# Altium project PlacaBase_agus.PrjPcb
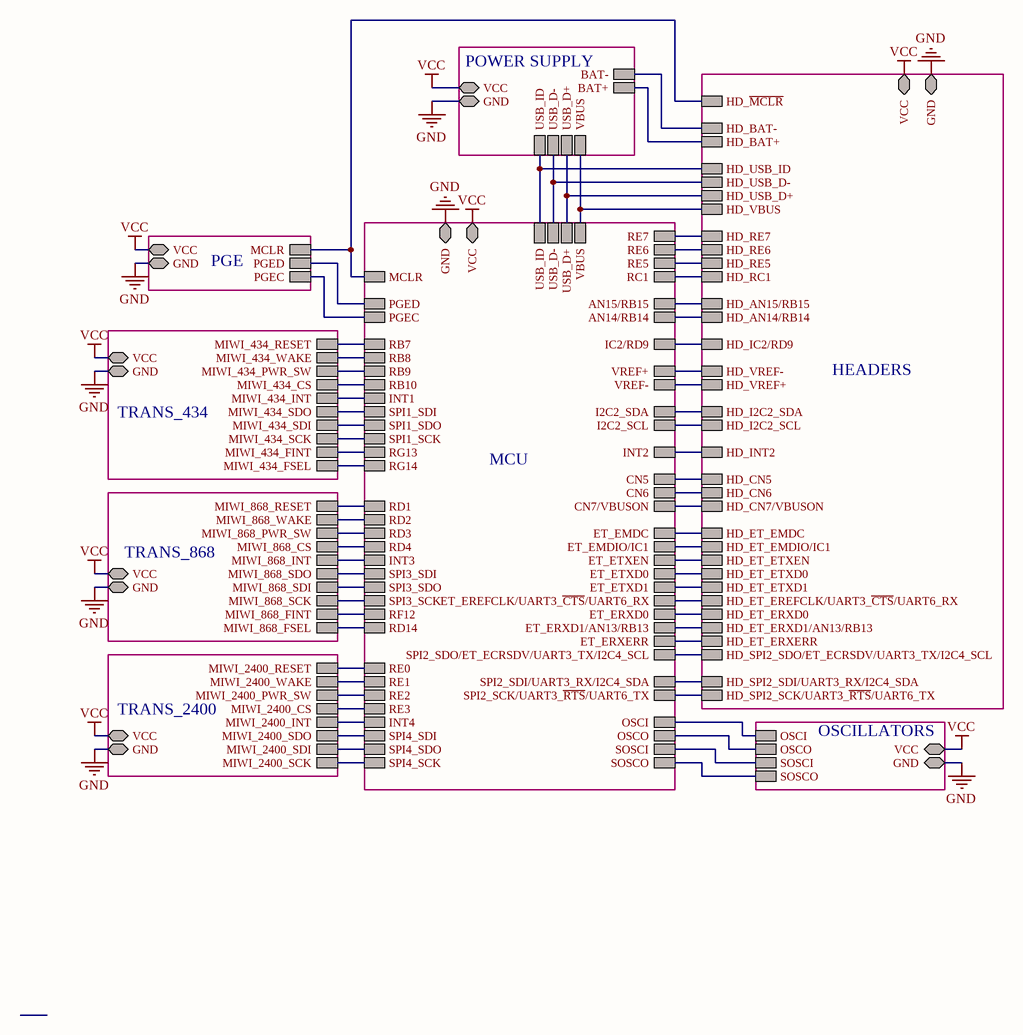
[diagram p0: PlacaBase_agus.SchDoc]
9 sheets, 60 parts. Net scope: hierarchical (ports join the sheet entries above them; power ports are global).
Board file: PlacaBase_agus.PcbDoc
Sheets:
  PlacaBase_agus.SchDoc
    PGE = PGE.SchDoc
    OSCILLATORS = oscillators.SchDoc
    HEADERS = headers.SchDoc
    TRANS_434 = transc_MIWI434.SchDoc
    TRANS_868 = transc_MIWI868.SchDoc
    TRANS_2400 = transc_MIWI2400.SchDoc
    POWER SUPPLY = power_supply.SchDoc
    MCU = MCU.SchDoc

## Sheet PlacaBase_agus.SchDoc
size B; PageSetup: Record=PageOptions|CenterHorizontal=True|CenterVertical=True|PrintScale=1.00|XCorrection=1.00|YCorrection=1.00|PrintKind=1|BorderSize=5000000|LeftOffset=0|BottomOffset=0|Orientation=2|PaperLength=1000|PaperWidth=1000|Scale=100|PaperSource=7|PrintQuality=-4|MediaType=1|DitherType=10|PaperKind=A4|PrintScaleMode=1

### Sub-sheets
HEADERS = headers.SchDoc: HD_RE5, HD_RE6, HD_RE7, HD_RC1, HD_AN15/RB15, HD_AN14/RB14, HD_INT2, HD_VREF+, HD_VREF-, HD_I2C2_SDA, HD_I2C2_SCL, HD_BAT+, HD_~{MCLR}, HD_CN6, HD_CN5, HD_CN7/VBUSON, HD_IC2/RD9, HD_BAT-, HD_USB_ID, HD_USB_D+, HD_USB_D-, HD_VBUS, HD_ET_EMDC, HD_ET_ETXEN, HD_ET_ETXD0, HD_ET_ETXD1, HD_ET_ERXD0, HD_ET_ERXERR, HD_SPI2_SCK/UART3_~{RTS}/UART6_TX, HD_SPI2_SDI/UART3_RX/I2C4_SDA, HD_SPI2_SDO/ET_ECRSDV/UART3_TX/I2C4_SCL, HD_ET_EREFCLK/UART3_~{CTS}/UART6_RX, HD_ET_EMDIO/IC1, HD_ET_ERXD1/AN13/RB13, VCC, GND
MCU = MCU.SchDoc: VBUS, PGED, PGEC, MCLR, SPI4_SDI, SPI4_SDO, SPI4_SCK, SPI1_SDO, SPI1_SDI, SPI1_SCK, SPI3_SCK, SPI3_SDI, SPI3_SDO, USB_ID, USB_D-, USB_D+, OSCI, OSCO, SOSCI, SOSCO, RE0, RE1, RE3, RB7, RD1, RB8, RD2, RB9, RD3, INT3, INT1, INT2, RB10, RD4, RE2, INT4, RE7, RE6, RE5, RC1, VREF-, VREF+, AN15/RB15, AN14/RB14, ET_ERXD1/AN13/RB13, I2C2_SCL, I2C2_SDA, CN7/VBUSON, CN6, CN5, ET_EMDIO/IC1, IC2/RD9, SPI2_SCK/UART3_~{RTS}/UART6_TX, SPI2_SDI/UART3_RX/I2C4_SDA, SPI2_SDO/ET_ECRSDV/UART3_TX/I2C4_SCL, ET_EREFCLK/UART3_~{CTS}/UART6_RX, ET_EMDC, ET_ETXEN, ET_ETXD0, ET_ETXD1, ET_ERXD0, ET_ERXERR, GND, VCC, RD14, RF12, RG13, RG14
OSCILLATORS = oscillators.SchDoc: OSCI, OSCO, SOSCI, SOSCO, VCC, GND
PGE = PGE.SchDoc: MCLR, PGED, PGEC, VCC, GND
POWER SUPPLY = power_supply.SchDoc: USB_ID, USB_D-, USB_D+, VBUS, BAT-, BAT+, GND, VCC
TRANS_434 = transc_MIWI434.SchDoc: MIWI_434_RESET, MIWI_434_WAKE, MIWI_434_INT, MIWI_434_SDI, MIWI_434_SCK, MIWI_434_CS, MIWI_434_SDO, MIWI_434_PWR_SW, VCC, GND, MIWI_434_FINT, MIWI_434_FSEL
TRANS_868 = transc_MIWI868.SchDoc: MIWI_868_RESET, MIWI_868_WAKE, MIWI_868_INT, MIWI_868_SDI, MIWI_868_SCK, MIWI_868_CS, MIWI_868_SDO, MIWI_868_PWR_SW, VCC, GND, MIWI_868_FINT, MIWI_868_FSEL
TRANS_2400 = transc_MIWI2400.SchDoc: MIWI_2400_RESET, MIWI_2400_WAKE, MIWI_2400_INT, MIWI_2400_SDI, MIWI_2400_SCK, MIWI_2400_CS, MIWI_2400_SDO, MIWI_2400_PWR_SW, VCC, GND

### Nets
GND: sheet PGE/GND, sheet OSCILLATORS/GND, sheet HEADERS/HD_BAT-, sheet HEADERS/GND, sheet TRANS_434/GND, sheet TRANS_868/GND, sheet TRANS_2400/GND, sheet POWER SUPPLY/BAT-, sheet POWER SUPPLY/GND, sheet MCU/GND
VCC: sheet PGE/VCC, sheet OSCILLATORS/VCC, sheet HEADERS/VCC, sheet TRANS_434/VCC, sheet TRANS_868/VCC, sheet TRANS_2400/VCC, sheet POWER SUPPLY/VCC, sheet MCU/VCC
VCC5.0_POWER: sheet HEADERS/HD_VBUS, sheet POWER SUPPLY/VBUS, sheet MCU/VBUS
NetC15_2: sheet OSCILLATORS/SOSCI, sheet MCU/SOSCI
NetC16_2: sheet OSCILLATORS/SOSCO, sheet MCU/SOSCO
NetC17_2: sheet OSCILLATORS/OSCI, sheet MCU/OSCI
NetC18_2: sheet OSCILLATORS/OSCO, sheet MCU/OSCO
Nethd40_00: sheet HEADERS/HD_INT2, sheet MCU/INT2
Nethd40_01: sheet HEADERS/HD_CN7/VBUSON, sheet MCU/CN7/VBUSON
Nethd40_02: sheet HEADERS/HD_CN5, sheet MCU/CN5
Nethd40_03: sheet HEADERS/HD_ET_ERXERR, sheet MCU/ET_ERXERR
Nethd40_04: sheet HEADERS/HD_ET_ERXD0, sheet MCU/ET_ERXD0
Nethd40_05: sheet HEADERS/HD_ET_ERXD1/AN13/RB13, sheet MCU/ET_ERXD1/AN13/RB13
Nethd40_06: sheet HEADERS/HD_USB_ID, sheet POWER SUPPLY/USB_ID, sheet MCU/USB_ID
Nethd40_08: sheet PGE/MCLR, sheet HEADERS/HD_~{MCLR}, sheet MCU/MCLR
Nethd40_09: sheet HEADERS/HD_ET_EMDIO/IC1, sheet MCU/ET_EMDIO/IC1
Nethd40_10: sheet HEADERS/HD_I2C2_SDA, sheet MCU/I2C2_SDA
Nethd40_11: sheet HEADERS/HD_I2C2_SCL, sheet MCU/I2C2_SCL
Nethd40_12: sheet HEADERS/HD_USB_D+, sheet POWER SUPPLY/USB_D+, sheet MCU/USB_D+
Nethd40_13: sheet HEADERS/HD_USB_D-, sheet POWER SUPPLY/USB_D-, sheet MCU/USB_D-
Nethd40_16: sheet HEADERS/HD_AN15/RB15, sheet MCU/AN15/RB15
Nethd40_17: sheet HEADERS/HD_AN14/RB14, sheet MCU/AN14/RB14
Nethd40_18: sheet HEADERS/HD_VREF-, sheet MCU/VREF+
Nethd40_19: sheet HEADERS/HD_VREF+, sheet MCU/VREF-
Nethd40_20: sheet HEADERS/HD_ET_EREFCLK/UART3_~{CTS}/UART6_RX, sheet MCU/ET_EREFCLK/UART3_~{CTS}/UART6_RX
Nethd40_21: sheet HEADERS/HD_SPI2_SDI/UART3_RX/I2C4_SDA, sheet MCU/SPI2_SDI/UART3_RX/I2C4_SDA
Nethd40_22: sheet HEADERS/HD_RE7, sheet MCU/RE7
Nethd40_23: sheet HEADERS/HD_RE5, sheet MCU/RE5
Nethd40_25: sheet HEADERS/HD_ET_ETXD0, sheet MCU/ET_ETXD0
Nethd40_26: sheet HEADERS/HD_ET_ETXD1, sheet MCU/ET_ETXD1
Nethd40_27: sheet HEADERS/HD_ET_EMDC, sheet MCU/ET_EMDC
Nethd40_29: sheet HEADERS/HD_BAT+, sheet POWER SUPPLY/BAT+
Nethd40_32: sheet HEADERS/HD_IC2/RD9, sheet MCU/IC2/RD9
Nethd40_33: sheet HEADERS/HD_ET_ETXEN, sheet MCU/ET_ETXEN
Nethd40_35: sheet HEADERS/HD_RE6, sheet MCU/RE6
Nethd40_36: sheet HEADERS/HD_RC1, sheet MCU/RC1
Nethd40_37: sheet HEADERS/HD_SPI2_SCK/UART3_~{RTS}/UART6_TX, sheet MCU/SPI2_SCK/UART3_~{RTS}/UART6_TX
Nethd40_38: sheet HEADERS/HD_SPI2_SDO/ET_ECRSDV/UART3_TX/I2C4_SCL, sheet MCU/SPI2_SDO/ET_ECRSDV/UART3_TX/I2C4_SCL
Nethd40_39: sheet HEADERS/HD_CN6, sheet MCU/CN6
NetMRF24J40MA_2: sheet TRANS_2400/MIWI_2400_RESET, sheet MCU/RE0
NetMRF24J40MA_3: sheet TRANS_2400/MIWI_2400_WAKE, sheet MCU/RE1
NetMRF24J40MA_4: sheet TRANS_2400/MIWI_2400_INT, sheet MCU/INT4
NetMRF24J40MA_5: sheet TRANS_2400/MIWI_2400_SDI, sheet MCU/SPI4_SDO
NetMRF24J40MA_6: sheet TRANS_2400/MIWI_2400_SCK, sheet MCU/SPI4_SCK
NetMRF24J40MA_7: sheet TRANS_2400/MIWI_2400_SDO, sheet MCU/SPI4_SDI
NetMRF24J40MA_8: sheet TRANS_2400/MIWI_2400_CS, sheet MCU/RE3
NetMRF49XAmboard_434_2: sheet TRANS_434/MIWI_434_RESET, sheet MCU/RB7
NetMRF49XAmboard_434_3: sheet TRANS_434/MIWI_434_WAKE, sheet MCU/RB8
NetMRF49XAmboard_434_4: sheet TRANS_434/MIWI_434_INT, sheet MCU/INT1
NetMRF49XAmboard_434_5: sheet TRANS_434/MIWI_434_SDI, sheet MCU/SPI1_SDO
NetMRF49XAmboard_434_6: sheet TRANS_434/MIWI_434_SCK, sheet MCU/SPI1_SCK
NetMRF49XAmboard_434_7: sheet TRANS_434/MIWI_434_SDO, sheet MCU/SPI1_SDI
NetMRF49XAmboard_434_8: sheet TRANS_434/MIWI_434_CS, sheet MCU/RB10
NetMRF49XAmboard_434_9: sheet TRANS_434/MIWI_434_FSEL, sheet MCU/RG14
NetMRF49XAmboard_434_10: sheet TRANS_434/MIWI_434_FINT, sheet MCU/RG13
NetMRF49XAmboard_868_2: sheet TRANS_868/MIWI_868_RESET, sheet MCU/RD1
NetMRF49XAmboard_868_3: sheet TRANS_868/MIWI_868_WAKE, sheet MCU/RD2
NetMRF49XAmboard_868_4: sheet TRANS_868/MIWI_868_INT, sheet MCU/INT3
NetMRF49XAmboard_868_5: sheet TRANS_868/MIWI_868_SDI, sheet MCU/SPI3_SDO
NetMRF49XAmboard_868_6: sheet TRANS_868/MIWI_868_SCK, sheet MCU/SPI3_SCK
NetMRF49XAmboard_868_7: sheet TRANS_868/MIWI_868_SDO, sheet MCU/SPI3_SDI
NetMRF49XAmboard_868_8: sheet TRANS_868/MIWI_868_CS, sheet MCU/RD4
NetMRF49XAmboard_868_9: sheet TRANS_868/MIWI_868_FSEL, sheet MCU/RD14
NetMRF49XAmboard_868_10: sheet TRANS_868/MIWI_868_FINT, sheet MCU/RF12
NetPC_434_6: sheet TRANS_434/MIWI_434_PWR_SW, sheet MCU/RB9
NetPC_868_6: sheet TRANS_868/MIWI_868_PWR_SW, sheet MCU/RD3
NetPC_2400_6: sheet TRANS_2400/MIWI_2400_PWR_SW, sheet MCU/RE2
NetPGE_2: sheet PGE/PGEC, sheet MCU/PGEC
NetPGE_3: sheet PGE/PGED, sheet MCU/PGED

## Sheet PGE.SchDoc
size A
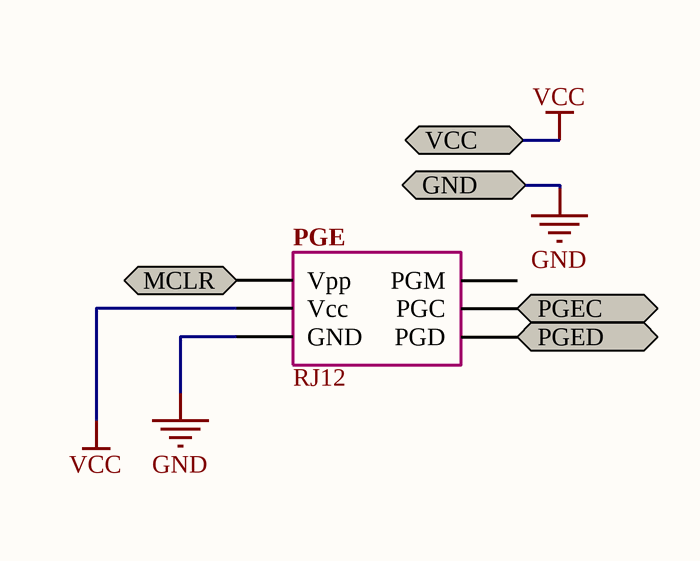
[diagram p1: PGE.SchDoc]

### Parts
PGE  RJ12  [RJ12]

### Ports
GND, MCLR, PGEC, PGED, VCC

### Nets
GND: PGE.4(GND) ; port GND
VCC: PGE.5(Vcc) ; port VCC
Nethd40_08: PGE.6(Vpp) ; port MCLR
NetPGE_2: PGE.2(PGC) ; port PGEC
NetPGE_3: PGE.3(PGD) ; port PGED

Not connected (* = marked no-connect by the designer): PGE 1(PGM)

### Library data of the parts
PGE = RJ12: Conector RJ-12; Note: Not recommended for new designs. Consider PIC16C72A or PIC16F72 instead.; buy: farnell:3938359; Published: 8-Jun-2000; LatestRevisionDate: 13-Apr-2006; LatestRevisionNote: IPC-7351 Footprint Added.; DatasheetVersion: DS39016A_1998; PackageVersion: 2005; PackageReference: SOIC300-28; Publisher: Altium Limited; PackageDescription: 28-Pin Small Outline Integrated Circuit 1.27 mm Pitch; Code_JEDEC: MS-013; ComponentLink1Description: Manufacturer Link; ComponentLink1URL: http://www.microchip.com; ComponentLink2Description: Datasheet; ComponentLink2URL: http://ww1.microchip.com/downloads/en/DeviceDoc/39016a.pdf; ComponentLink3Description: Packaging Specification; ComponentLink3URL: http://ww1.microchip.com/downloads/en/PackagingSpec/00049AD.pdf

## Sheet oscillators.SchDoc
size A
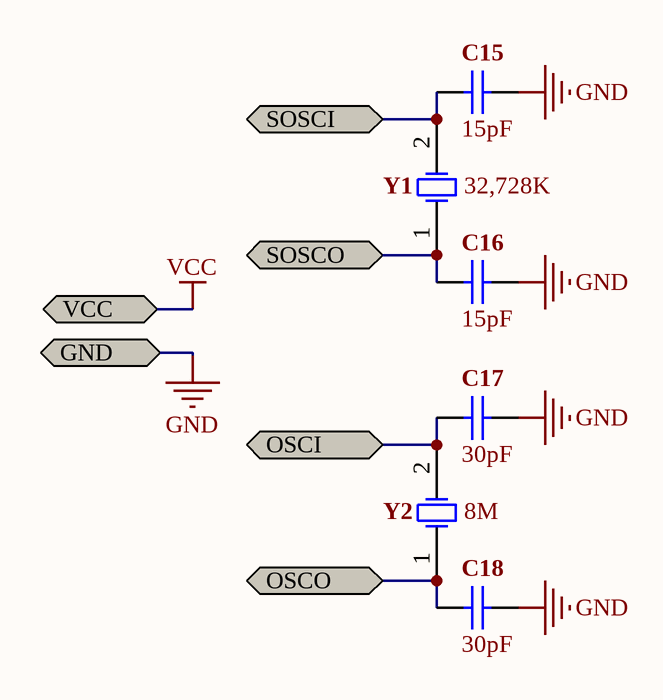
[diagram p2: oscillators.SchDoc]

### Parts
C15  value 15pF  [1608[0603]]  (hidden comment: Cap)
C16  value 15pF  [1608[0603]]  (hidden comment: Cap)
C17  value 30pF  [1608[0603]]  (hidden comment: Cap)
C18  value 30pF  [1608[0603]]  (hidden comment: Cap)
Y1  32,728K  [BCY-W2/D3.1]
Y2  8M  [49_SMD_8Mhz]

### Ports
GND, OSCI, OSCO, SOSCI, SOSCO, VCC

### Nets
GND: C15.1 C16.1 C17.1 C18.1 ; port GND
NetC15_2: C15.2 Y1.2(OSC2) ; port SOSCI
NetC16_2: C16.2 Y1.1(OSC1) ; port SOSCO
NetC17_2: C17.2 Y2.2(OSC2) ; port OSCI
NetC18_2: C18.2 Y2.1(OSC1) ; port OSCO

### Library data of the parts
C15-C18 = Cap: Capacitor; Published: 8-Jun-2000; LatestRevisionDate: 17-Jul-2002; LatestRevisionNote: Re-released for DXP Platform.; PackageReference: RAD-0.3; Publisher: Altium Limited; PackageDescription: Radial Cap, Thru-Hole; 2 Leads; 0.3 in Pin Spacing
Y1 Y2 = XTAL_2PINS: Crystal Oscillator; buy: farnell:1701100; Published: 8-Jun-2000; LatestRevisionDate: 17-Jul-2002; LatestRevisionNote: Re-released for DXP Platform.; PackageReference: R38; Publisher: Altium Limited

## Sheet headers.SchDoc
size A4
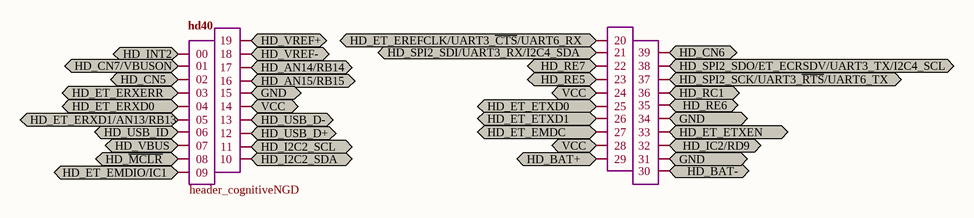
[diagram p3: headers.SchDoc]

### Parts
hd40  header_cognitiveNGD  [header_cognitiveNGD]

### Ports
GND, HD_AN14/RB14, HD_AN15/RB15, HD_BAT+, HD_BAT-, HD_CN5, HD_CN6, HD_CN7/VBUSON, HD_ET_EMDC, HD_ET_EMDIO/IC1, HD_ET_EREFCLK/UART3_~{CTS}/UART6_RX, HD_ET_ERXD0, HD_ET_ERXD1/AN13/RB13, HD_ET_ERXERR, HD_ET_ETXD0, HD_ET_ETXD1, HD_ET_ETXEN, HD_I2C2_SCL, HD_I2C2_SDA, HD_IC2/RD9, HD_INT2, HD_RC1, HD_RE5, HD_RE6, HD_RE7, HD_SPI2_SCK/UART3_~{RTS}/UART6_TX, HD_SPI2_SDI/UART3_RX/I2C4_SDA, HD_SPI2_SDO/ET_ECRSDV/UART3_TX/I2C4_SCL, HD_USB_D+, HD_USB_D-, HD_USB_ID, HD_VBUS, HD_VREF+, HD_VREF-, HD_~{MCLR}, VCC

### Nets
GND: hd40.15 hd40.30 hd40.31 hd40.34 ; port GND, port HD_BAT-
VCC: hd40.14 hd40.24 hd40.28 ; port VCC
VCC5.0_POWER: hd40.07 ; port HD_VBUS
Nethd40_00: hd40.00 ; port HD_INT2
Nethd40_01: hd40.01 ; port HD_CN7/VBUSON
Nethd40_02: hd40.02 ; port HD_CN5
Nethd40_03: hd40.03 ; port HD_ET_ERXERR
Nethd40_04: hd40.04 ; port HD_ET_ERXD0
Nethd40_05: hd40.05 ; port HD_ET_ERXD1/AN13/RB13
Nethd40_06: hd40.06 ; port HD_USB_ID
Nethd40_08: hd40.08 ; port HD_~{MCLR}
Nethd40_09: hd40.09 ; port HD_ET_EMDIO/IC1
Nethd40_10: hd40.10 ; port HD_I2C2_SDA
Nethd40_11: hd40.11 ; port HD_I2C2_SCL
Nethd40_12: hd40.12 ; port HD_USB_D+
Nethd40_13: hd40.13 ; port HD_USB_D-
Nethd40_16: hd40.16 ; port HD_AN15/RB15
Nethd40_17: hd40.17 ; port HD_AN14/RB14
Nethd40_18: hd40.18 ; port HD_VREF-
Nethd40_19: hd40.19 ; port HD_VREF+
Nethd40_20: hd40.20 ; port HD_ET_EREFCLK/UART3_~{CTS}/UART6_RX
Nethd40_21: hd40.21 ; port HD_SPI2_SDI/UART3_RX/I2C4_SDA
Nethd40_22: hd40.22 ; port HD_RE7
Nethd40_23: hd40.23 ; port HD_RE5
Nethd40_25: hd40.25 ; port HD_ET_ETXD0
Nethd40_26: hd40.26 ; port HD_ET_ETXD1
Nethd40_27: hd40.27 ; port HD_ET_EMDC
Nethd40_29: hd40.29 ; port HD_BAT+
Nethd40_32: hd40.32 ; port HD_IC2/RD9
Nethd40_33: hd40.33 ; port HD_ET_ETXEN
Nethd40_35: hd40.35 ; port HD_RE6
Nethd40_36: hd40.36 ; port HD_RC1
Nethd40_37: hd40.37 ; port HD_SPI2_SCK/UART3_~{RTS}/UART6_TX
Nethd40_38: hd40.38 ; port HD_SPI2_SDO/ET_ECRSDV/UART3_TX/I2C4_SCL
Nethd40_39: hd40.39 ; port HD_CN6

## Sheet transc_MIWI434.SchDoc
size A
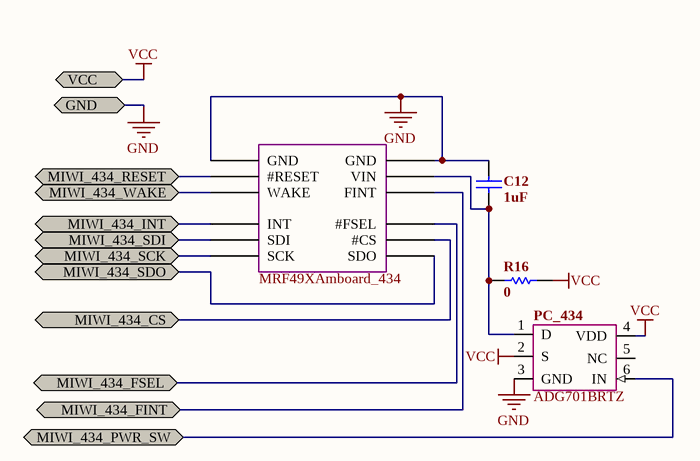
[diagram p4: transc_MIWI434.SchDoc]

### Parts
C12  value 1uF  [1608[0603]]  (hidden comment: Cap)
MRF49XAmboard_434  MRF49XAmboard  [MRF49XAmboard]  (value not drawn)
PC_434  ADG701BRTZ  [SOT23-6_L]
R16  value 0  [1608[0603]]  (hidden comment: resistor)

### Ports
GND, MIWI_434_CS, MIWI_434_FINT, MIWI_434_FSEL, MIWI_434_INT, MIWI_434_PWR_SW, MIWI_434_RESET, MIWI_434_SCK, MIWI_434_SDI, MIWI_434_SDO, MIWI_434_WAKE, VCC

### Nets
GND: C12.1 MRF49XAmboard_434.1(GND) MRF49XAmboard_434.12(GND) PC_434.3(GND) ; port GND
VCC: PC_434.2(S) PC_434.4(VDD) R16.1 ; port VCC
NetC12_2: C12.2 MRF49XAmboard_434.11(VIN) PC_434.1(D) R16.2
NetMRF49XAmboard_434_2: MRF49XAmboard_434.2(#RESET) ; port MIWI_434_RESET
NetMRF49XAmboard_434_3: MRF49XAmboard_434.3(WAKE) ; port MIWI_434_WAKE
NetMRF49XAmboard_434_4: MRF49XAmboard_434.4(INT) ; port MIWI_434_INT
NetMRF49XAmboard_434_5: MRF49XAmboard_434.5(SDI) ; port MIWI_434_SDI
NetMRF49XAmboard_434_6: MRF49XAmboard_434.6(SCK) ; port MIWI_434_SCK
NetMRF49XAmboard_434_7: MRF49XAmboard_434.7(SDO) ; port MIWI_434_SDO
NetMRF49XAmboard_434_8: MRF49XAmboard_434.8(#CS) ; port MIWI_434_CS
NetMRF49XAmboard_434_9: MRF49XAmboard_434.9(#FSEL) ; port MIWI_434_FSEL
NetMRF49XAmboard_434_10: MRF49XAmboard_434.10(FINT) ; port MIWI_434_FINT
NetPC_434_6: PC_434.6(IN) ; port MIWI_434_PWR_SW

Not connected (* = marked no-connect by the designer): PC_434 5(NC)

### Library data of the parts
C12 = Cap: Capacitor
MRF49XAmboard_434 = MRF49XAmboard: Microchip RF radio; buy: farnell:1630202
R16 = RES

## Sheet transc_MIWI868.SchDoc
size A
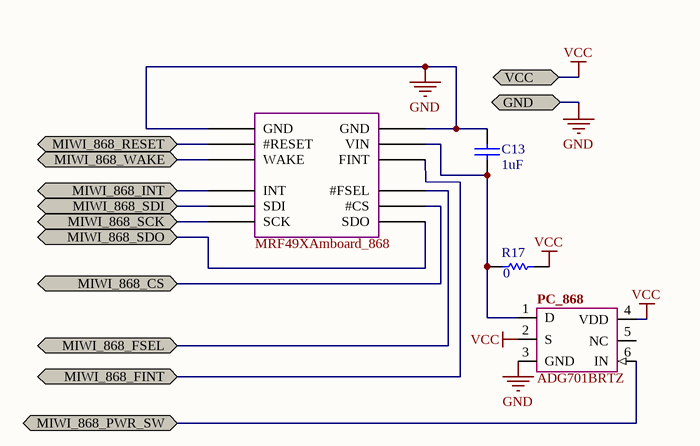
[diagram p5: transc_MIWI868.SchDoc]

### Parts
C13  value 1uF  [1608[0603]]  (hidden comment: Cap)
MRF49XAmboard_868  MRF49XAmboard  [MRF49XAmboard]  (value not drawn)
PC_868  ADG701BRTZ  [SOT23-6_L]
R17  value 0  [1608[0603]]  (hidden comment: resistor)

### Ports
GND, MIWI_868_CS, MIWI_868_FINT, MIWI_868_FSEL, MIWI_868_INT, MIWI_868_PWR_SW, MIWI_868_RESET, MIWI_868_SCK, MIWI_868_SDI, MIWI_868_SDO, MIWI_868_WAKE, VCC

### Nets
GND: C13.1 MRF49XAmboard_868.1(GND) MRF49XAmboard_868.12(GND) PC_868.3(GND) ; port GND
VCC: PC_868.2(S) PC_868.4(VDD) R17.1 ; port VCC
NetC13_2: C13.2 MRF49XAmboard_868.11(VIN) PC_868.1(D) R17.2
NetMRF49XAmboard_868_2: MRF49XAmboard_868.2(#RESET) ; port MIWI_868_RESET
NetMRF49XAmboard_868_3: MRF49XAmboard_868.3(WAKE) ; port MIWI_868_WAKE
NetMRF49XAmboard_868_4: MRF49XAmboard_868.4(INT) ; port MIWI_868_INT
NetMRF49XAmboard_868_5: MRF49XAmboard_868.5(SDI) ; port MIWI_868_SDI
NetMRF49XAmboard_868_6: MRF49XAmboard_868.6(SCK) ; port MIWI_868_SCK
NetMRF49XAmboard_868_7: MRF49XAmboard_868.7(SDO) ; port MIWI_868_SDO
NetMRF49XAmboard_868_8: MRF49XAmboard_868.8(#CS) ; port MIWI_868_CS
NetMRF49XAmboard_868_9: MRF49XAmboard_868.9(#FSEL) ; port MIWI_868_FSEL
NetMRF49XAmboard_868_10: MRF49XAmboard_868.10(FINT) ; port MIWI_868_FINT
NetPC_868_6: PC_868.6(IN) ; port MIWI_868_PWR_SW

Not connected (* = marked no-connect by the designer): PC_868 5(NC)

### Library data of the parts
C13 = Cap: Capacitor; Published: 8-Jun-2000; LatestRevisionDate: 17-Jul-2002; LatestRevisionNote: Re-released for DXP Platform.; PackageReference: RAD-0.3; Publisher: Altium Limited; PackageDescription: Radial Cap, Thru-Hole; 2 Leads; 0.3 in Pin Spacing
MRF49XAmboard_868 = MRF49XAmboard: Microchip RF radio; buy: farnell:1630202
R17 = RES: Published: 8-Jun-2000; LatestRevisionDate: 17-Jul-2002; LatestRevisionNote: Re-released for DXP Platform.; PackageReference: AXIAL-0.3; Publisher: Altium Limited; PackageDescription: Axial Device, Thru-Hole; 2 Leads; 0.3 in Pin Spacing

## Sheet transc_MIWI2400.SchDoc
size A; PageSetup: Record=PageOptions|CenterHorizontal=True|CenterVertical=True|PrintScale=1.00|XCorrection=1.00|YCorrection=1.00|PrintKind=1|BorderSize=5000000|LeftOffset=0|BottomOffset=0|Orientation=2|PaperLength=1000|PaperWidth=1000|Scale=100|PaperSource=7|PrintQuality=-4|MediaType=1|DitherType=10|PaperKind=A4|PrintScaleMode=1
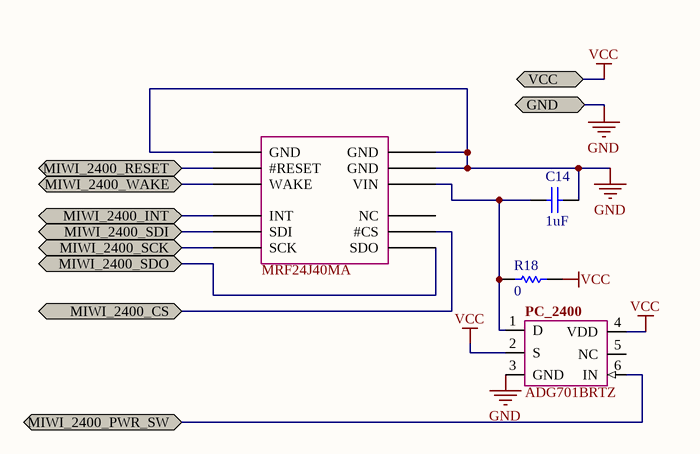
[diagram p6: transc_MIWI2400.SchDoc]

### Parts
C14  value 1uF  [1608[0603]]  (hidden comment: Cap)
MRF24J40MA  MRF24J40MA  [MRF24J40MA]  (value not drawn)
PC_2400  ADG701BRTZ  [SOT23-6_L]
R18  value 0  [1608[0603]]  (hidden comment: resistor)

### Ports
GND, MIWI_2400_CS, MIWI_2400_INT, MIWI_2400_PWR_SW, MIWI_2400_RESET, MIWI_2400_SCK, MIWI_2400_SDI, MIWI_2400_SDO, MIWI_2400_WAKE, VCC

### Nets
GND: C14.1 MRF24J40MA.1(GND) MRF24J40MA.11(GND) MRF24J40MA.12(GND) PC_2400.3(GND) ; port GND
VCC: PC_2400.2(S) PC_2400.4(VDD) R18.1 ; port VCC
NetC14_2: C14.2 MRF24J40MA.10(VIN) PC_2400.1(D) R18.2
NetMRF24J40MA_2: MRF24J40MA.2(#RESET) ; port MIWI_2400_RESET
NetMRF24J40MA_3: MRF24J40MA.3(WAKE) ; port MIWI_2400_WAKE
NetMRF24J40MA_4: MRF24J40MA.4(INT) ; port MIWI_2400_INT
NetMRF24J40MA_5: MRF24J40MA.5(SDI) ; port MIWI_2400_SDI
NetMRF24J40MA_6: MRF24J40MA.6(SCK) ; port MIWI_2400_SCK
NetMRF24J40MA_7: MRF24J40MA.7(SDO) ; port MIWI_2400_SDO
NetMRF24J40MA_8: MRF24J40MA.8(#CS) ; port MIWI_2400_CS
NetPC_2400_6: PC_2400.6(IN) ; port MIWI_2400_PWR_SW

Not connected (* = marked no-connect by the designer): MRF24J40MA 9(NC); PC_2400 5(NC)

### Library data of the parts
C14 = Cap: Capacitor; Published: 8-Jun-2000; LatestRevisionDate: 17-Jul-2002; LatestRevisionNote: Re-released for DXP Platform.; PackageReference: RAD-0.3; Publisher: Altium Limited; PackageDescription: Radial Cap, Thru-Hole; 2 Leads; 0.3 in Pin Spacing
MRF24J40MA = MRF24J40MA: Microchip RF radio; buy: farnell:1630202
R18 = RES: Published: 8-Jun-2000; LatestRevisionDate: 17-Jul-2002; LatestRevisionNote: Re-released for DXP Platform.; PackageReference: AXIAL-0.3; Publisher: Altium Limited; PackageDescription: Axial Device, Thru-Hole; 2 Leads; 0.3 in Pin Spacing

## Sheet power_supply.SchDoc
size A; PageSetup: Record=PageOptions|CenterHorizontal=True|CenterVertical=True|PrintScale=1.00|XCorrection=1.00|YCorrection=1.00|PrintKind=1|BorderSize=5000000|LeftOffset=0|BottomOffset=0|Orientation=2|PaperLength=1000|PaperWidth=1000|Scale=100|PaperSource=7|PrintQuality=-4|MediaType=1|DitherType=10|PaperKind=A4|PrintScaleMode=1
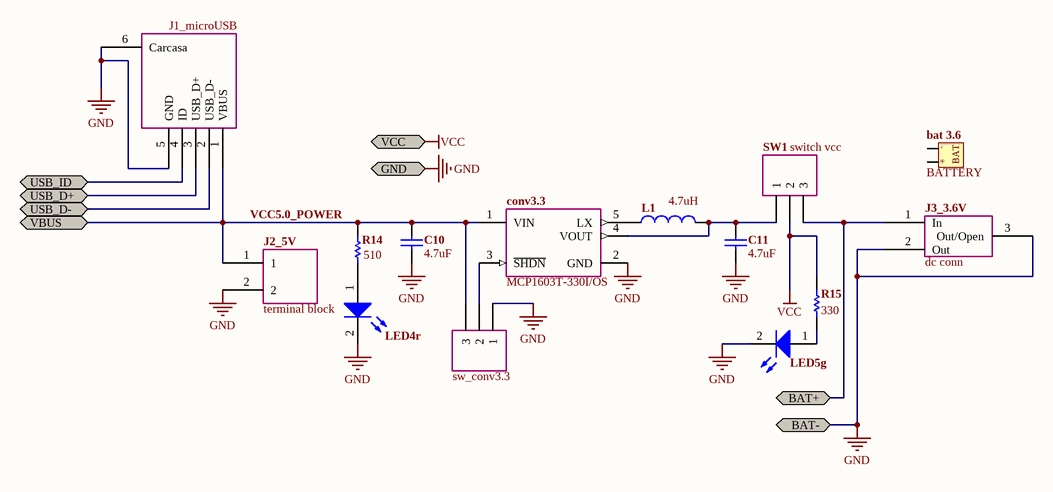
[diagram p7: power_supply.SchDoc]

### Parts
bat_3.6  BATTERY  [BATTERY HOLDER 3 cells]
C10  value 4.7uF  [1608[0603]]  (hidden comment: Cap)
C11  value 4.7uF  [1608[0603]]  (hidden comment: Cap)
conv3.3  MCP1603T-330I/OS  [TSOT-OS5_N]
J1_microUSB  J1_microUSB  [microUSB AB]
J2_5V  terminal block  [Conector ED-1631]
J3_3.6V  dc conn  [DC Connector]
L1  value 4.7uH  [CD3225-1210]  (hidden comment: L)
LED4r  LED_SMD_Hg  [1608[0603]]  (value not drawn)
LED5g  LED_SMD_Hg  [1608[0603]]  (value not drawn)
R14  value 510  [1608[0603]]  (hidden comment: Res1)
R15  value 330  [1608[0603]]  (hidden comment: R)
SW1  switch vcc  [SWITCH-2]
SW2  sw_conv3.3  [HDR1X3]

### Ports
BAT+, BAT-, GND, USB_D+, USB_D-, USB_ID, VBUS, VCC

### Nets
GND: C10.1 C11.1 conv3.3.2(GND) J1_microUSB.5(GND) J1_microUSB.6(Carcasa) J2_5V.2 J3_3.6V.2(Out) J3_3.6V.3(Out/Open) LED4r.2(K) LED5g.2(K) SW2.1 ; port BAT-, port GND
VCC: R15.2 SW1.2 ; port VCC
VCC5.0_POWER: C10.2 conv3.3.1(VIN) J1_microUSB.1(VBUS) J2_5V.1 R14.1 SW2.3 ; port VBUS
NetC11_2: C11.2 conv3.3.4(VOUT) L1.2 SW1.1
Netconv3.3_3: conv3.3.3(~{SHDN}) SW2.2
Netconv3.3_5: conv3.3.5(LX) L1.1
Nethd40_06: J1_microUSB.4(ID) ; port USB_ID
Nethd40_12: J1_microUSB.3(USB_D+) ; port USB_D+
Nethd40_13: J1_microUSB.2(USB_D-) ; port USB_D-
Nethd40_29: J3_3.6V.1(In) SW1.3 ; port BAT+
NetLED4r_1: LED4r.1(A) R14.2
NetLED5g_1: LED5g.1(A) R15.1

### Notes on the sheet
- (in symbol BATTERY) -; +; BAT

### Library data of the parts
C10 C11 = Cap: Capacitor; Published: 8-Jun-2000; LatestRevisionDate: 17-Jul-2002; LatestRevisionNote: Re-released for DXP Platform.; PackageReference: RAD-0.3; Publisher: Altium Limited; PackageDescription: Radial Cap, Thru-Hole; 2 Leads; 0.3 in Pin Spacing
conv3.3 = MCP1603T-330I/OS: 500mA Synchronous Buck Regulator, 3.3V, 2.0 MHz, 5-Pin TSOT, Industrial Temperature, Tape and Reel; Published: 29-Jan-2009; DatasheetVersion: revA, May-2007; PackageVersion: revAW, Oct-2008; PackageReference: TSOT-OS5; Publisher: Altium Limited; PackageDescription: 5-Lead Plastic Small Outline Transistor (OS) [TSOT]; ComponentLink1Description: Manufacturer Link; ComponentLink1URL: http://www.microchip.com; ComponentLink2Description: Datasheet; ComponentLink2URL: http://ww1.microchip.com/downloads/en/DeviceDoc/22042a.pdf; ComponentLink3Description: Packaging Specification; ComponentLink3URL: http://ww1.microchip.com/downloads/en/PackagingSpec/00049AW.pdf
J1_microUSB = USB micro AB: buy: farnell:1568022
J2_5V = Conector ED-1631: Terminal Block 2 vías, 5mm
J3_3.6V = DC Connector: buy: farnell:
L1 = L: Inductor; Manufacturer: Generic Components; Class: Passive; buy: farnell:1717469; Published: 08/06/2000; Publisher: Altium Hobart Technology Centre; SubClass: Inductor
LED4r LED5g = LED_SMD_Hg: Typical BLUE SiC LED; Manufacturer: Generic Components; Class: Optoelectronic; Published: 08/06/2000; Publisher: Altium Hobart Technology Centre; SubClass: LED
R14 = Res1: Resistor; Published: 8-Jun-2000; LatestRevisionDate: 17-Jul-2002; LatestRevisionNote: Re-released for DXP Platform.; PackageReference: AXIAL-0.3; Publisher: Altium Limited; PackageDescription: Axial Device, Thru-Hole; 2 Leads; 0.3 in Pin Spacing
R15 = R: Resistor; Manufacturer: Generic Components; Class: Passive; Published: 08/06/2000; Publisher: Altium Hobart Technology Centre; SubClass: Resistor
SW1 SW2 = SWITCH-2: Header, 3-Pin; LatestRevisionDate: 17-Jul-2002; LatestRevisionNote: Re-released for DXP Platform.; Publisher: Altium Limited

## Sheet MCU.SchDoc
size A3; PageSetup: Record=PageOptions|CenterHorizontal=True|CenterVertical=True|PrintScale=1.00|XCorrection=1.00|YCorrection=1.00|PrintKind=1|BorderSize=5000000|LeftOffset=0|BottomOffset=0|Orientation=2|PaperLength=1000|PaperWidth=1000|Scale=100|PaperSource=7|PrintQuality=-4|MediaType=1|DitherType=10|PaperKind=A4|PrintScaleMode=1
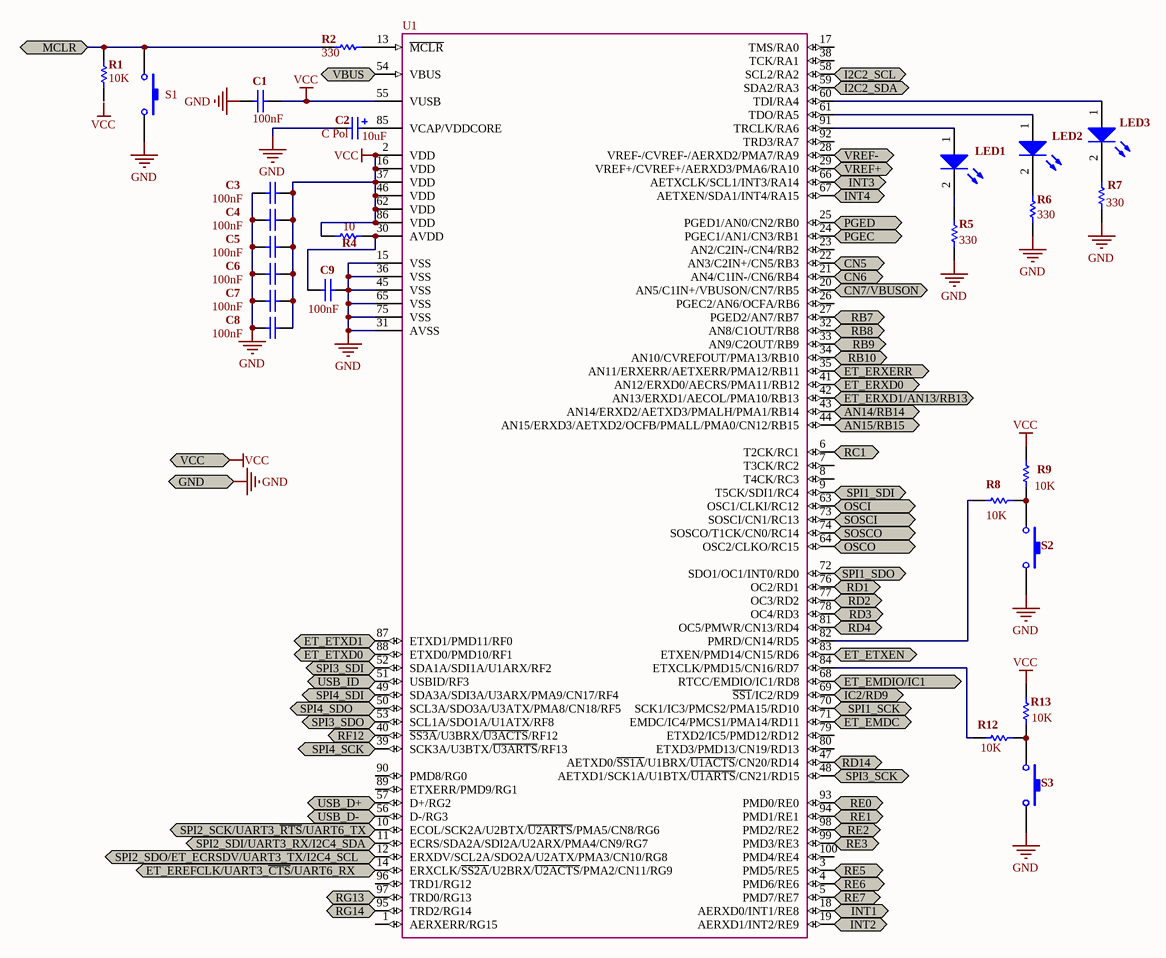
[diagram p8: MCU.SchDoc]

### Parts
C1  value 100nF  [1608[0603]]  (hidden comment: Cap)
C2  C Pol  value 10uF  [1206[3216]]
C3  value 100nF  [1608[0603]]  (hidden comment: Cap)
C4  value 100nF  [1608[0603]]  (hidden comment: Cap)
C5  value 100nF  [1608[0603]]  (hidden comment: Cap)
C6  value 100nF  [1608[0603]]  (hidden comment: Cap)
C7  value 100nF  [1608[0603]]  (hidden comment: Cap)
C8  value 100nF  [1608[0603]]  (hidden comment: Cap)
C9  value 100nF  [1608[0603]]  (hidden comment: Cap)
LED1  LED_SMD_Hg  [1608[0603]]  (value not drawn)
LED2  LED_SMD_Hg  [1608[0603]]  (value not drawn)
LED3  LED_SMD_Hg  [1608[0603]]  (value not drawn)
R1  value 10K  [1608[0603]]  (hidden comment: R)
R2  value 330  [1608[0603]]  (hidden comment: Res1)
R4  value 10  [1608[0603]]  (hidden comment: R)
R5  value 330  [1608[0603]]  (hidden comment: R)
R6  value 330  [1608[0603]]  (hidden comment: R)
R7  value 330  [1608[0603]]  (hidden comment: R)
R8  value 10K  [1608[0603]]  (hidden comment: R)
R9  value 10K  [1608[0603]]  (hidden comment: R)
R12  value 10K  [1608[0603]]  (hidden comment: R)
R13  value 10K  [1608[0603]]  (hidden comment: R)
s1_rst  S1  [Pulsador]
S2  Pulsador  [Pulsador]  (value not drawn)
S3  Pulsador  [Pulsador]  (value not drawn)
U1  PIC32MX675F512L-80I/PT  [TQFP-PT100_N]  (value not drawn)

### Ports
AN14/RB14, AN15/RB15, CN5, CN6, CN7/VBUSON, ET_EMDC, ET_EMDIO/IC1, ET_EREFCLK/UART3_~{CTS}/UART6_RX, ET_ERXD0, ET_ERXD1/AN13/RB13, ET_ERXERR, ET_ETXD0, ET_ETXD1, ET_ETXEN, GND, I2C2_SCL, I2C2_SDA, IC2/RD9, INT1, INT2, INT3, INT4, MCLR, OSCI, OSCO, PGEC, PGED, RB7, RB8, RB9, RB10, RC1, RD1, RD2, RD3, RD4, RD14, RE0, RE1, RE2, RE3, RE5, RE6, RE7, RF12, RG13, RG14, SOSCI, SOSCO, SPI1_SCK, SPI1_SDI, SPI1_SDO, SPI2_SCK/UART3_~{RTS}/UART6_TX, SPI2_SDI/UART3_RX/I2C4_SDA, SPI2_SDO/ET_ECRSDV/UART3_TX/I2C4_SCL, SPI3_SCK, SPI3_SDI, SPI3_SDO, SPI4_SCK, SPI4_SDI, SPI4_SDO, USB_D+, USB_D-, USB_ID, VBUS, VCC, VREF+, VREF-

### Nets
GND: C1.2 C2.2 C3.1 C4.1 C5.1 C6.1 C7.1 C8.1 C9.1 R5.1 R6.1 R7.1 s1_rst.2 S2.2 S3.2 U1.15(VSS) U1.31(AVSS) U1.36(VSS) U1.45(VSS) U1.65(VSS) U1.75(VSS) ; port GND
VCC: C1.1 C3.2 C4.2 C5.2 C6.2 C7.2 C8.2 R4.2 R9.2 R13.2 U1.2(VDD) U1.16(VDD) U1.37(VDD) U1.46(VDD) U1.55(VUSB) U1.62(VDD) U1.86(VDD) ; port VCC
VCC5.0_POWER: U1.54(VBUS) ; port VBUS
NetC2_1: C2.1 U1.85(VCAP/VDDCORE)
NetC9_2: C9.2 R4.1 U1.30(AVDD)
NetC15_2: U1.73(SOSCI/CN1/RC13) ; port SOSCI
NetC16_2: U1.74(SOSCO/T1CK/CN0/RC14) ; port SOSCO
NetC17_2: U1.63(OSC1/CLKI/RC12) ; port OSCI
NetC18_2: U1.64(OSC2/CLKO/RC15) ; port OSCO
Nethd40_00: U1.19(AERXD1/INT2/RE9) ; port INT2
Nethd40_01: U1.20(AN5/C1IN+/VBUSON/CN7/RB5) ; port CN7/VBUSON
Nethd40_02: U1.22(AN3/C2IN+/CN5/RB3) ; port CN5
Nethd40_03: U1.35(AN11/ERXERR/AETXERR/PMA12/RB11) ; port ET_ERXERR
Nethd40_04: U1.41(AN12/ERXD0/AECRS/PMA11/RB12) ; port ET_ERXD0
Nethd40_05: U1.42(AN13/ERXD1/AECOL/PMA10/RB13) ; port ET_ERXD1/AN13/RB13
Nethd40_06: U1.51(USBID/RF3) ; port USB_ID
Nethd40_08: R1.1 R2.1 s1_rst.1 ; port MCLR
Nethd40_09: U1.68(RTCC/EMDIO/IC1/RD8) ; port ET_EMDIO/IC1
Nethd40_10: U1.59(SDA2/RA3) ; port I2C2_SDA
Nethd40_11: U1.58(SCL2/RA2) ; port I2C2_SCL
Nethd40_12: U1.57(D+/RG2) ; port USB_D+
Nethd40_13: U1.56(D-/RG3) ; port USB_D-
Nethd40_16: U1.44(AN15/ERXD3/AETXD2/OCFB/PMALL/PMA0/CN12/RB15) ; port AN15/RB15
Nethd40_17: U1.43(AN14/ERXD2/AETXD3/PMALH/PMA1/RB14) ; port AN14/RB14
Nethd40_18: U1.29(VREF+/CVREF+/AERXD3/PMA6/RA10) ; port VREF+
Nethd40_19: U1.28(VREF-/CVREF-/AERXD2/PMA7/RA9) ; port VREF-
Nethd40_20: U1.14(ERXCLK/~{SS2A}/U2BRX/~{U2ACTS}/PMA2/CN11/RG9) ; port ET_EREFCLK/UART3_~{CTS}/UART6_RX
Nethd40_21: U1.11(ECRS/SDA2A/SDI2A/U2ARX/PMA4/CN9/RG7) ; port SPI2_SDI/UART3_RX/I2C4_SDA
Nethd40_22: U1.5(PMD7/RE7) ; port RE7
Nethd40_23: U1.3(PMD5/RE5) ; port RE5
Nethd40_25: U1.88(ETXD0/PMD10/RF1) ; port ET_ETXD0
Nethd40_26: U1.87(ETXD1/PMD11/RF0) ; port ET_ETXD1
Nethd40_27: U1.71(EMDC/IC4/PMCS1/PMA14/RD11) ; port ET_EMDC
Nethd40_32: U1.69(~{SS1}/IC2/RD9) ; port IC2/RD9
Nethd40_33: U1.83(ETXEN/PMD14/CN15/RD6) ; port ET_ETXEN
Nethd40_35: U1.4(PMD6/RE6) ; port RE6
Nethd40_36: U1.6(T2CK/RC1) ; port RC1
Nethd40_37: U1.10(ECOL/SCK2A/U2BTX/~{U2ARTS}/PMA5/CN8/RG6) ; port SPI2_SCK/UART3_~{RTS}/UART6_TX
Nethd40_38: U1.12(ERXDV/SCL2A/SDO2A/U2ATX/PMA3/CN10/RG8) ; port SPI2_SDO/ET_ECRSDV/UART3_TX/I2C4_SCL
Nethd40_39: U1.21(AN4/C1IN-/CN6/RB4) ; port CN6
NetLED1_1: LED1.1(A) U1.91(TRCLK/RA6)
NetLED1_2: LED1.2(K) R5.2
NetLED2_1: LED2.1(A) U1.61(TDO/RA5)
NetLED2_2: LED2.2(K) R6.2
NetLED3_1: LED3.1(A) U1.60(TDI/RA4)
NetLED3_2: LED3.2(K) R7.2
NetMRF24J40MA_2: U1.93(PMD0/RE0) ; port RE0
NetMRF24J40MA_3: U1.94(PMD1/RE1) ; port RE1
NetMRF24J40MA_4: U1.67(AETXEN/SDA1/INT4/RA15) ; port INT4
NetMRF24J40MA_5: U1.50(SCL3A/SDO3A/U3ATX/PMA8/CN18/RF5) ; port SPI4_SDO
NetMRF24J40MA_6: U1.39(SCK3A/U3BTX/~{U3ARTS}/RF13) ; port SPI4_SCK
NetMRF24J40MA_7: U1.49(SDA3A/SDI3A/U3ARX/PMA9/CN17/RF4) ; port SPI4_SDI
NetMRF24J40MA_8: U1.99(PMD3/RE3) ; port RE3
NetMRF49XAmboard_434_2: U1.27(PGED2/AN7/RB7) ; port RB7
NetMRF49XAmboard_434_3: U1.32(AN8/C1OUT/RB8) ; port RB8
NetMRF49XAmboard_434_4: U1.18(AERXD0/INT1/RE8) ; port INT1
NetMRF49XAmboard_434_5: U1.72(SDO1/OC1/INT0/RD0) ; port SPI1_SDO
NetMRF49XAmboard_434_6: U1.70(SCK1/IC3/PMCS2/PMA15/RD10) ; port SPI1_SCK
NetMRF49XAmboard_434_7: U1.9(T5CK/SDI1/RC4) ; port SPI1_SDI
NetMRF49XAmboard_434_8: U1.34(AN10/CVREFOUT/PMA13/RB10) ; port RB10
NetMRF49XAmboard_434_9: U1.95(TRD2/RG14) ; port RG14
NetMRF49XAmboard_434_10: U1.97(TRD0/RG13) ; port RG13
NetMRF49XAmboard_868_2: U1.76(OC2/RD1) ; port RD1
NetMRF49XAmboard_868_3: U1.77(OC3/RD2) ; port RD2
NetMRF49XAmboard_868_4: U1.66(AETXCLK/SCL1/INT3/RA14) ; port INT3
NetMRF49XAmboard_868_5: U1.53(SCL1A/SDO1A/U1ATX/RF8) ; port SPI3_SDO
NetMRF49XAmboard_868_6: U1.48(AETXD1/SCK1A/U1BTX/~{U1ARTS}/CN21/RD15) ; port SPI3_SCK
NetMRF49XAmboard_868_7: U1.52(SDA1A/SDI1A/U1ARX/RF2) ; port SPI3_SDI
NetMRF49XAmboard_868_8: U1.81(OC5/PMWR/CN13/RD4) ; port RD4
NetMRF49XAmboard_868_9: U1.47(AETXD0/~{SS1A}/U1BRX/~{U1ACTS}/CN20/RD14) ; port RD14
NetMRF49XAmboard_868_10: U1.40(~{SS3A}/U3BRX/~{U3ACTS}/RF12) ; port RF12
NetPC_434_6: U1.33(AN9/C2OUT/RB9) ; port RB9
NetPC_868_6: U1.78(OC4/RD3) ; port RD3
NetPC_2400_6: U1.98(PMD2/RE2) ; port RE2
NetPGE_2: U1.24(PGEC1/AN1/CN3/RB1) ; port PGEC
NetPGE_3: U1.25(PGED1/AN0/CN2/RB0) ; port PGED
NetR2_2: R2.2 U1.13(~{MCLR})
NetR8_1: R8.1 R9.1 S2.1
NetR8_2: R8.2 U1.82(PMRD/CN14/RD5)
NetR12_1: R12.1 R13.1 S3.1
NetR12_2: R12.2 U1.84(ETXCLK/PMD15/CN16/RD7)

Not connected (* = marked no-connect by the designer): R1 2; U1 1(AERXERR/RG15) 7(T3CK/RC2) 8(T4CK/RC3) 17(TMS/RA0) 23(AN2/C2IN-/CN4/RB2) 26(PGEC2/AN6/OCFA/RB6) 38(TCK/RA1) 79(ETXD2/IC5/PMD12/RD12) 80(ETXD3/PMD13/CN19/RD13) 89(ETXERR/PMD9/RG1) 90(PMD8/RG0) 92(TRD3/RA7) 96(TRD1/RG12) 100(PMD4/RE4)

### Notes on the sheet
- Labels drawn without touching a wire or pin: VCC
- Title
- Size:
- Date:
- A3
- Number:
- Time:
- Revision:
- Sheet
- of
- File:

### Library data of the parts
C1 C3-C9 = Cap: Capacitor; Published: 8-Jun-2000; LatestRevisionDate: 17-Jul-2002; LatestRevisionNote: Re-released for DXP Platform.; PackageReference: RAD-0.3; Publisher: Altium Limited; PackageDescription: Radial Cap, Thru-Hole; 2 Leads; 0.3 in Pin Spacing
C2 = C Pol: Polarized Capacitor (Surface Mount); Manufacturer: Generic Components; Class: Passive; Published: 08/06/2000; Publisher: Altium Hobart Technology Centre; SubClass: Capacitor
LED1-LED3 = LED_SMD_Hg: as LED4r on sheet power_supply; Published: 08/06/2000; Publisher: Altium Hobart Technology Centre; SubClass: LED
R1 R4-R9 R12 R13 = R: as R15 on sheet power_supply; Published: 08/06/2000; Publisher: Altium Hobart Technology Centre; SubClass: Resistor
R2 = Res1: Resistor; Published: 8-Jun-2000; LatestRevisionDate: 17-Jul-2002; LatestRevisionNote: Re-released for DXP Platform.; PackageReference: AXIAL-0.3; Publisher: Altium Limited; PackageDescription: Axial Device, Thru-Hole; 2 Leads; 0.3 in Pin Spacing
s1_rst S2 S3 = Pulsador: Switch; Manufacturer: Generic Components; Published: 1999
U1 = PIC32MX675F512L-80I/PT: High Performance 80 MHz MIPS-Based 32-Bit Flash Microcontroller with USB and Ethernet, 512KB Program Memory, 100-pin TQFP, Industrial Temperature; FirstPublished: 2-Dec-2009; DatasheetVersion: revB, Nov-2009; PackageVersion: revBB, Aug-2009; PackageReference: TQFP-PT100; Publisher: Altium Limited; PackageDescription: 100-Lead Plastic Thin Quad Flatpack (PT) - 12x12x1mm Body, 2.00mm [TQFP]; Supplier 1: Digi-Key; Supplier Part Number 1: PIC32MX675F512L-80I/PT-ND; Supplier 2: Newark; Supplier Part Number 2: 25R8403; ComponentLink1Description: Datasheet; ComponentLink1URL: http://ww1.microchip.com/downloads/en/DeviceDoc/DS-61156B.pdf; ComponentLink2Description: Packaging Specification; ComponentLink2URL: http://ww1.microchip.com/downloads/en/PackagingSpec/en012702.pdf; ComponentLink3Description: Microchip.com Home; ComponentLink3URL: http://www.microchip.com/

## Nets that join several sheets
GND: PGE (PGE.4), oscillators (C15.1 C16.1 C17.1 C18.1), headers (hd40.15 hd40.30 hd40.31 hd40.34), transc_MIWI434 (C12.1 MRF49XAmboard_434.1 MRF49XAmboard_434.12 PC_434.3), transc_MIWI868 (C13.1 MRF49XAmboard_868.1 MRF49XAmboard_868.12 PC_868.3), transc_MIWI2400 (5 pins), power_supply (11 pins), MCU (21 pins)
VCC: PGE (PGE.5), headers (hd40.14 hd40.24 hd40.28), transc_MIWI434 (PC_434.2 PC_434.4 R16.1), transc_MIWI868 (PC_868.2 PC_868.4 R17.1), transc_MIWI2400 (PC_2400.2 PC_2400.4 R18.1), power_supply (R15.2 SW1.2), MCU (17 pins)
NetC15_2: oscillators (C15.2 Y1.2), MCU (U1.73)
NetC16_2: oscillators (C16.2 Y1.1), MCU (U1.74)
NetC17_2: oscillators (C17.2 Y2.2), MCU (U1.63)
NetC18_2: oscillators (C18.2 Y2.1), MCU (U1.64)
Nethd40_00: headers (hd40.00), MCU (U1.19)
Nethd40_01: headers (hd40.01), MCU (U1.20)
Nethd40_02: headers (hd40.02), MCU (U1.22)
Nethd40_03: headers (hd40.03), MCU (U1.35)
Nethd40_04: headers (hd40.04), MCU (U1.41)
Nethd40_05: headers (hd40.05), MCU (U1.42)
Nethd40_06: headers (hd40.06), power_supply (J1_microUSB.4), MCU (U1.51)
Nethd40_08: PGE (PGE.6), headers (hd40.08), MCU (R1.1 R2.1 s1_rst.1)
Nethd40_09: headers (hd40.09), MCU (U1.68)
Nethd40_10: headers (hd40.10), MCU (U1.59)
Nethd40_11: headers (hd40.11), MCU (U1.58)
Nethd40_12: headers (hd40.12), power_supply (J1_microUSB.3), MCU (U1.57)
Nethd40_13: headers (hd40.13), power_supply (J1_microUSB.2), MCU (U1.56)
Nethd40_16: headers (hd40.16), MCU (U1.44)
Nethd40_17: headers (hd40.17), MCU (U1.43)
Nethd40_18: headers (hd40.18), MCU (U1.29)
Nethd40_19: headers (hd40.19), MCU (U1.28)
Nethd40_20: headers (hd40.20), MCU (U1.14)
Nethd40_21: headers (hd40.21), MCU (U1.11)
Nethd40_22: headers (hd40.22), MCU (U1.5)
Nethd40_23: headers (hd40.23), MCU (U1.3)
Nethd40_25: headers (hd40.25), MCU (U1.88)
Nethd40_26: headers (hd40.26), MCU (U1.87)
Nethd40_27: headers (hd40.27), MCU (U1.71)
Nethd40_29: headers (hd40.29), power_supply (J3_3.6V.1 SW1.3)
Nethd40_32: headers (hd40.32), MCU (U1.69)
Nethd40_33: headers (hd40.33), MCU (U1.83)
Nethd40_35: headers (hd40.35), MCU (U1.4)
Nethd40_36: headers (hd40.36), MCU (U1.6)
Nethd40_37: headers (hd40.37), MCU (U1.10)
Nethd40_38: headers (hd40.38), MCU (U1.12)
Nethd40_39: headers (hd40.39), MCU (U1.21)
NetMRF24J40MA_2: transc_MIWI2400 (MRF24J40MA.2), MCU (U1.93)
NetMRF24J40MA_3: transc_MIWI2400 (MRF24J40MA.3), MCU (U1.94)
NetMRF24J40MA_4: transc_MIWI2400 (MRF24J40MA.4), MCU (U1.67)
NetMRF24J40MA_5: transc_MIWI2400 (MRF24J40MA.5), MCU (U1.50)
NetMRF24J40MA_6: transc_MIWI2400 (MRF24J40MA.6), MCU (U1.39)
NetMRF24J40MA_7: transc_MIWI2400 (MRF24J40MA.7), MCU (U1.49)
NetMRF24J40MA_8: transc_MIWI2400 (MRF24J40MA.8), MCU (U1.99)
NetMRF49XAmboard_434_2: transc_MIWI434 (MRF49XAmboard_434.2), MCU (U1.27)
NetMRF49XAmboard_434_3: transc_MIWI434 (MRF49XAmboard_434.3), MCU (U1.32)
NetMRF49XAmboard_434_4: transc_MIWI434 (MRF49XAmboard_434.4), MCU (U1.18)
NetMRF49XAmboard_434_5: transc_MIWI434 (MRF49XAmboard_434.5), MCU (U1.72)
NetMRF49XAmboard_434_6: transc_MIWI434 (MRF49XAmboard_434.6), MCU (U1.70)
NetMRF49XAmboard_434_7: transc_MIWI434 (MRF49XAmboard_434.7), MCU (U1.9)
NetMRF49XAmboard_434_8: transc_MIWI434 (MRF49XAmboard_434.8), MCU (U1.34)
NetMRF49XAmboard_434_9: transc_MIWI434 (MRF49XAmboard_434.9), MCU (U1.95)
NetMRF49XAmboard_434_10: transc_MIWI434 (MRF49XAmboard_434.10), MCU (U1.97)
NetMRF49XAmboard_868_2: transc_MIWI868 (MRF49XAmboard_868.2), MCU (U1.76)
NetMRF49XAmboard_868_3: transc_MIWI868 (MRF49XAmboard_868.3), MCU (U1.77)
NetMRF49XAmboard_868_4: transc_MIWI868 (MRF49XAmboard_868.4), MCU (U1.66)
NetMRF49XAmboard_868_5: transc_MIWI868 (MRF49XAmboard_868.5), MCU (U1.53)
NetMRF49XAmboard_868_6: transc_MIWI868 (MRF49XAmboard_868.6), MCU (U1.48)
NetMRF49XAmboard_868_7: transc_MIWI868 (MRF49XAmboard_868.7), MCU (U1.52)
NetMRF49XAmboard_868_8: transc_MIWI868 (MRF49XAmboard_868.8), MCU (U1.81)
NetMRF49XAmboard_868_9: transc_MIWI868 (MRF49XAmboard_868.9), MCU (U1.47)
NetMRF49XAmboard_868_10: transc_MIWI868 (MRF49XAmboard_868.10), MCU (U1.40)
NetPC_434_6: transc_MIWI434 (PC_434.6), MCU (U1.33)
NetPC_868_6: transc_MIWI868 (PC_868.6), MCU (U1.78)
NetPC_2400_6: transc_MIWI2400 (PC_2400.6), MCU (U1.98)
NetPGE_2: PGE (PGE.2), MCU (U1.24)
NetPGE_3: PGE (PGE.3), MCU (U1.25)
VCC5.0_POWER: headers (hd40.07), power_supply (6 pins), MCU (U1.54)